# EAGLE schematic hwreset_v1 (EAGLE 6.1)
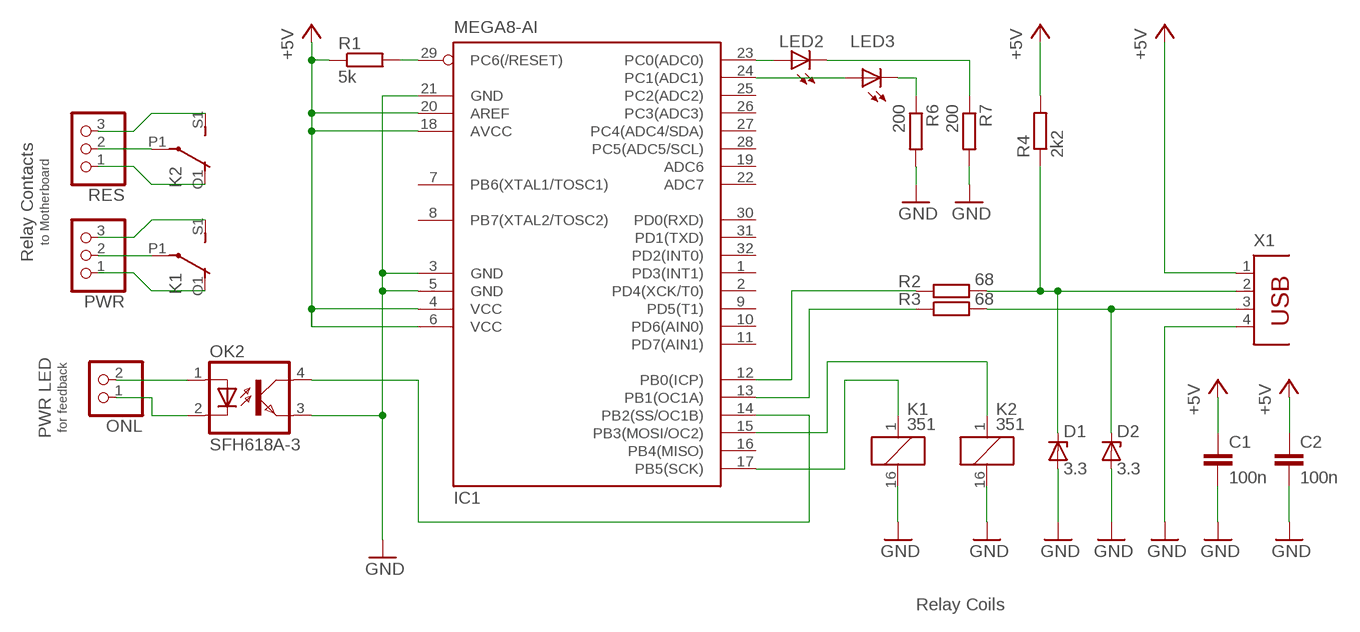
[diagram p0: schematic, sheet 1]

## Parts
C1  100n  C-EU025-025X050  [C025-025X050]
C2  100n  C-EU025-025X050  [C025-025X050]
D1  3.3  ZENER-DIODEZD-2.5  [ZDIO-2.5]
D2  3.3  ZENER-DIODEZD-2.5  [ZDIO-2.5]
IC1  MEGA8-AI  [TQFP32-08]
K1  351  [351]
K2  351  [351]
LED2  LED3MM  [LED3MM]
LED3  LED3MM  [LED3MM]
OK2  SFH618A-3  [DIP4]
ONL  PINHD-1X2  [1X02]
PWR  PINHD-1X3  [1X03]
R1  5k  R-EU_0204/2V  [0204V]
R2  68  R-EU_0204/2V  [0204V]
R3  68  R-EU_0204/2V  [0204V]
R4  2k2  R-EU_0204/2V  [0204V]
R6  200  R-EU_0204/2V  [0204V]
R7  200  R-EU_0204/2V  [0204V]
RES  PINHD-1X3  [1X03]
X1  PN87520  [PN87520]

## Nets
+5V: C1.1 C2.1 IC1.4(VCC) IC1.6(VCC) IC1.18(AVCC) IC1.20(AREF) R1.1 R4.2 X1.1
GND: C1.2 C2.2 D1.A IC1.3(GND) IC1.5(GND) IC1.21(GND) K1.16 K2.16 OK2.3(EMIT) R6.2 R7.2 X1.4
N$1: IC1.29(PC6(/RESET)) R1.2
N$2: IC1.17(PB5(SCK)) K1.1
N$3: K2.P1(2:P) RES.2
N$4: IC1.12(PB0(ICP)) R2.1
N$5: IC1.13(PB1(OC1A)) R3.1
N$6: K1.P1(2:P) PWR.2
N$7: D2.A ; supply symbol labelled GND
N$8: D1.C R2.2 R4.1 X1.2
N$9: D2.C R3.2 X1.3
N$10: K1.O1(2:O) PWR.1
N$11: K1.S1(2:S) PWR.3
N$12: K2.O1(2:O) RES.1
N$13: K2.S1(2:S) RES.3
N$14: OK2.1(A) ONL.2
N$15: OK2.2(C) ONL.1
N$16: IC1.14(PB2(SS/OC1B)) OK2.4(COL)
N$17: IC1.23(PC0(ADC0)) LED2.A
N$18: IC1.15(PB3(MOSI/OC2)) K2.1
N$19: IC1.24(PC1(ADC1)) LED3.A
N$20: LED2.K(C) R7.1
N$21: LED3.K(C) R6.1
Unconnected: IC1.1(PD3(INT1)) IC1.2(PD4(XCK/T0)) IC1.7(PB6(XTAL1/TOSC1)) IC1.8(PB7(XTAL2/TOSC2)) IC1.9(PD5(T1)) IC1.10(PD6(AIN0)) IC1.11(PD7(AIN1)) IC1.16(PB4(MISO)) IC1.19(ADC6) IC1.22(ADC7) IC1.25(PC2(ADC2)) IC1.26(PC3(ADC3)) IC1.27(PC4(ADC4/SDA)) IC1.28(PC5(ADC5/SCL)) IC1.30(PD0(RXD)) IC1.31(PD1(TXD)) IC1.32(PD2(INT0)) K1.O2(3:O) K1.P2(3:P) K1.S2(3:S) K2.O2(3:O) K2.P2(3:P) K2.S2(3:S)

## Notes on the sheet
- Relay Contacts | to Motherboard
- PWR LED | for feedback
- Relay Coils

## Library data of the parts
C1 C2 = rcl:C-EU: CAPACITOR, European symbol
D1 D2 = diode:ZENER-DIODE: Z-Diode
IC1 = atmel:MEGA8: MICROCONTROLLER 8 Kbytes FLASH, 1 kbytes SRAM, 512 bytes EEPROM, USART, 6-channel 10 bit ADC, 2-channel 8 bit ADC Pin compatible with Atmega48, ATMega88, ATMega168 Source: avr.lbr; MPN: ATMEGA8-16AU; OC_FARNELL: 9171371; OC_NEWARK: 73M8863
K1 K2 = relay:351: RELAY 2 x switch, Omron; OC_FARNELL: unknown; OC_NEWARK: unknown
LED2 LED3 = led:LED: LED OSRAM: - CHIPLED LG R971, LG N971, LY N971, LG Q971, LY Q971, LO R971, LY R971 LH N974, LH R974 LS Q976, LO Q976, LY Q976 LO Q996 - Hyper CHIPLED LW Q18S LB Q993, LB Q99A, LB R99A - SideLED LS A670, LO A670, LY A670, LG A670, LP A670 LB A673, LV A673, LT A673, LW A673 LH A674 LY A675 LS A676, LA A676, LO A676, LY A676, LW A676 LS A679, LY A679, LG A679 - Hyper Micro SIDELED® LS Y876, LA Y876, LO Y876, LY Y876 LT Y87S - SmartLED LW L88C, LW L88S LB L89C, LB L89S, LG L890 LS L89K, LO L89K, LY L89K LS L896, LA L896, LO L896, LY L896 - TOPLED LS T670, LO T670, LY T670, LG T670, LP T670 LSG T670, LSP T670, LSY T670, LOP T670, LYG T670 LG T671, LOG T671, LSG T671 LB T673, LV T673, LT T673, LW T673 LH T674 LS T676, LA T676, LO T676, LY T676, LB T676, LH T676, LSB T676, LW T676 LB T67C, LV T67C, LT T67C, LS T67K, LO T67K, LY T67K, LW E67C LS E67B, LA E67B, LO E67B, LY E67B, LB E67C, LV E67C, LT E67C LW T67C LS T679, LY T679, LG T679 LS T770, LO T770, LY T770, LG T770, LP T770 LB T773, LV T773, LT T773, LW T773 LH T774 LS E675, LA E675, LY E675, LS T675 LS T776, LA T776, LO T776, LY T776, LB T776 LHGB T686 LT T68C, LB T68C - Hyper Mini TOPLED® LB M676 - Mini TOPLED Santana® LG M470 LS M47K, LO M47K, LY M47K Source: http://www.osram.convergy.de LUXEON: - LUMILED® LXK2-PW12-R00, LXK2-PW12-S00, LXK2-PW14-U00, LXK2-PW14-V00 LXK2-PM12-R00, LXK2-PM12-S00, LXK2-PM14-U00 LXK2-PE12-Q00, LXK2-PE12-R00, LXK2-PE12-S00, LXK2-PE14-T00, LXK2-PE14-U00 LXK2-PB12-K00, LXK2-PB12-L00, LXK2-PB12-M00, LXK2-PB14-N00, LXK2-PB14-P00, LXK2-PB14-Q00 LXK2-PR12-L00, LXK2-PR12-M00, LXK2-PR14-Q00, LXK2-PR14-R00 LXK2-PD12-Q00, LXK2-PD12-R00, LXK2-PD12-S00 LXK2-PH12-R00, LXK2-PH12-S00 LXK2-PL12-P00, LXK2-PL12-Q00, LXK2-PL12-R00 Source: www.luxeon.com KINGBRIGHT: KA-3528ASYC Source: www.kingbright.com
OK2 = optocoupler:SFH618?*: Optocoupler, Phototransistor Output, Low Input Current Source: http://www.vishay.com/docs/83673/sfh618.pdf; MF: VISHAY/TELEFUNKEN; MPN: SFH618A-3; OC_FARNELL: 1020374; OC_NEWARK: 58K2209
ONL = pinhead:PINHD-1X2: PIN HEADER
PWR RES = pinhead:PINHD-1X3: PIN HEADER
R1-R4 R6 R7 = rcl:R-EU_: RESISTOR, European symbol
X1 = con-berg:PN87520: BERG USB connector; OC_FARNELL: unknown; OC_NEWARK: unknown